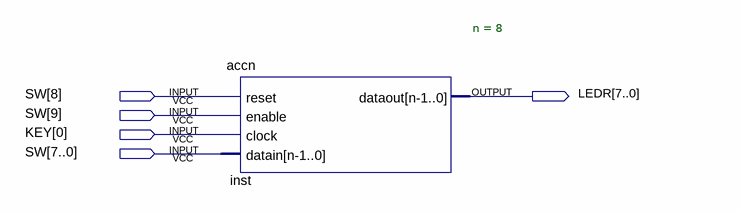
[diagram p0: schematic sheet]
// Quartus schematic AccN_Demo.bdf as structural Verilog: 1 symbols, 5 pins
module AccN_Demo (
  input  [9:0] SW,
  input  [0:0] KEY,
  output [7:0] LEDR
);

  accn #(.n(8)) inst (.reset(SW[8]), .enable(SW[9]), .clock(KEY[0]), .datain(SW[7:0]), .dataout(LEDR));
endmodule
